# Altium schematic sheet MB-02-MainController.SchDoc
size 330 x 228 mm
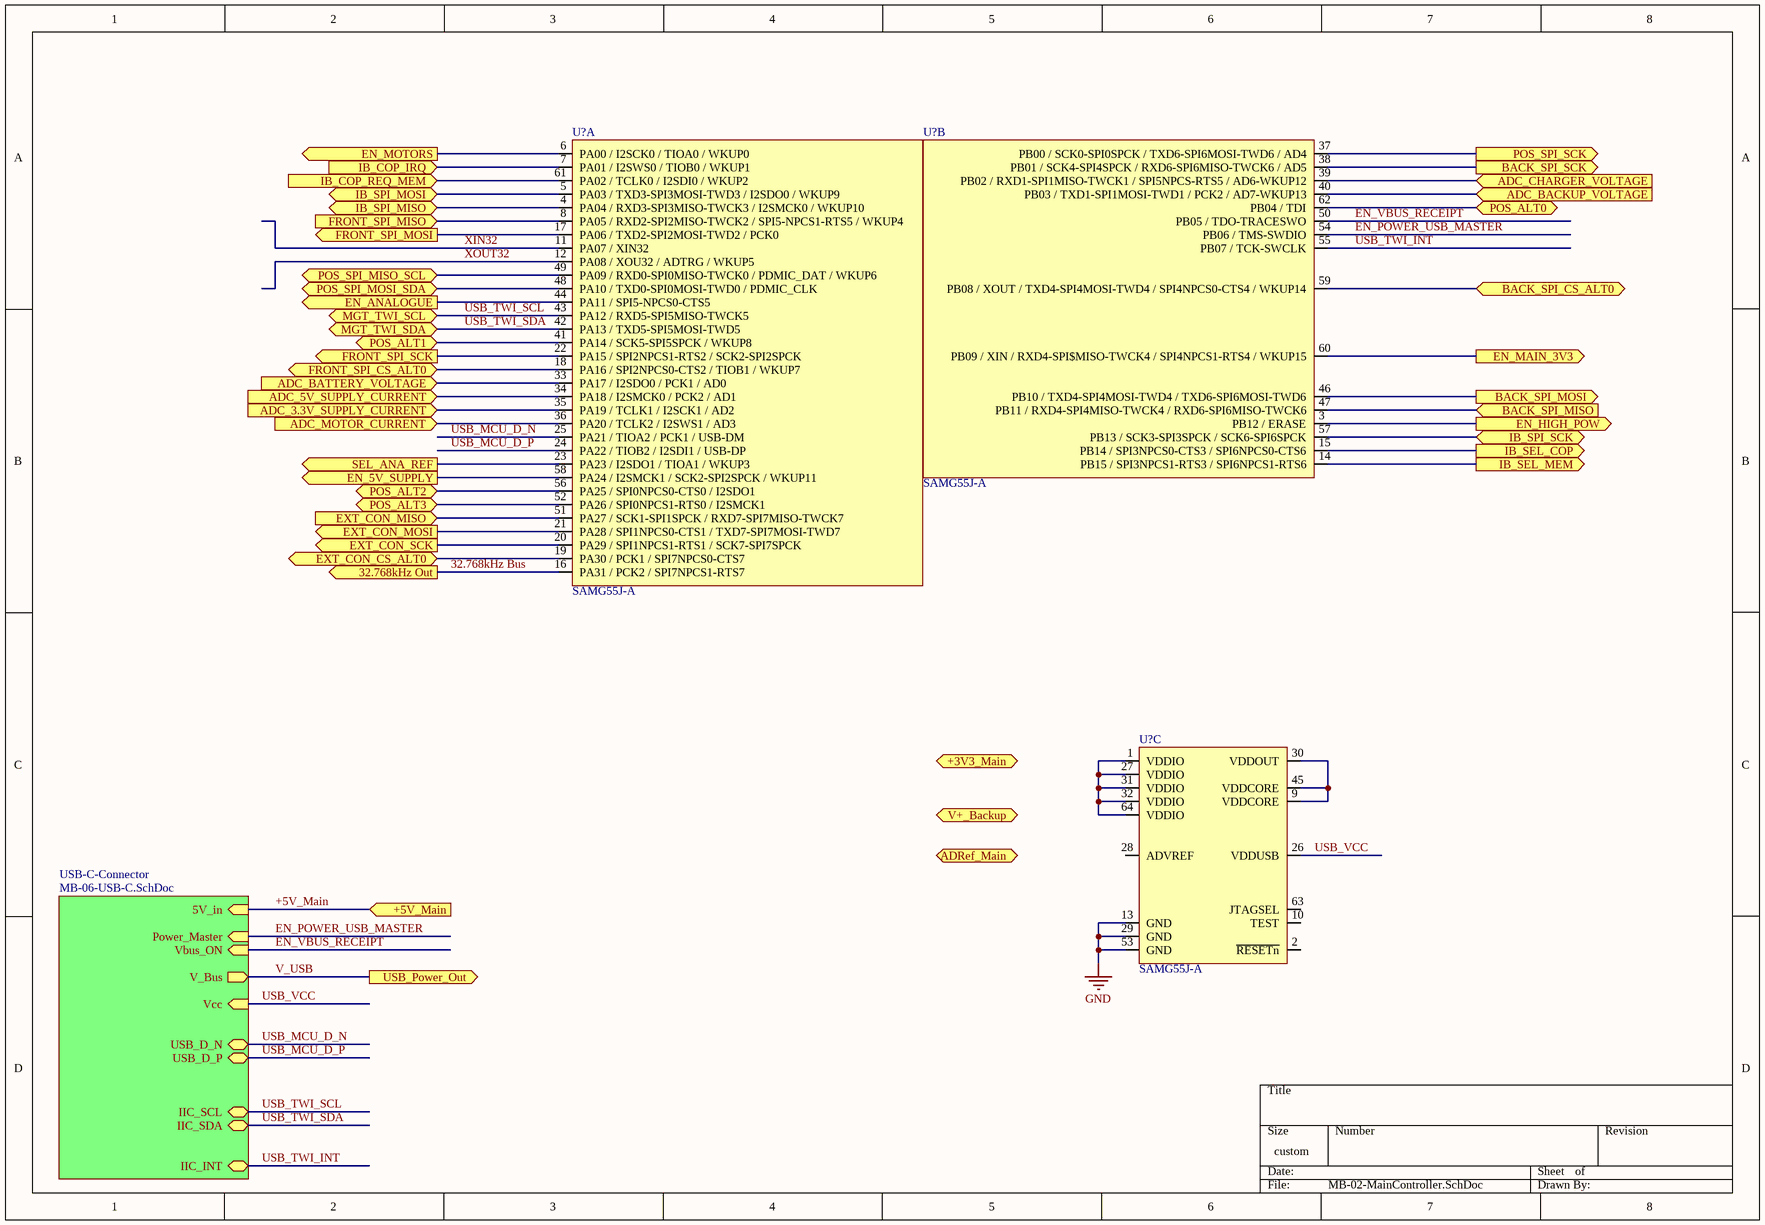
[diagram p0: MB-02-MainController.SchDoc]

## Parts
(Parts that share a designator on the sheet are numbered #1, #2 ... from top to bottom, then left to right.)
U?#1  SAMG55J-A  (part A of 3)
U?#2  SAMG55J-A  (part B of 3)
U?#3  SAMG55J-A  (part C of 3)

## Sub-sheets
USB-C-Connector = MB-06-USB-C.SchDoc: USB_D_P (bidir), USB_D_N (bidir), IIC_SCL (bidir), IIC_SDA (bidir), IIC_INT (bidir), V_Bus (out), Vcc (in), 5V_in (in), Power_Master (in), Vbus_ON (in)

## Ports
32.768kHz Out (out), +3V3_Main (in), +5V_Main (in), ADC_3.3V_SUPPLY_CURRENT (in), ADC_5V_SUPPLY_CURRENT (in), ADC_BACKUP_VOLTAGE (in), ADC_BATTERY_VOLTAGE (in), ADC_CHARGER_VOLTAGE (in), ADC_MOTOR_CURRENT (in), ADRef_Main (in), BACK_SPI_CS_ALT0 (bidir), BACK_SPI_MISO (in), BACK_SPI_MOSI (out), BACK_SPI_SCK (out), EN_5V_SUPPLY (out), EN_ANALOGUE (out), EN_HIGH_POW (out), EN_MAIN_3V3 (out), EN_MOTORS (out), EXT_CON_CS_ALT0 (bidir), EXT_CON_MISO (in), EXT_CON_MOSI (out), EXT_CON_SCK (out), FRONT_SPI_CS_ALT0 (bidir), FRONT_SPI_MISO (in), FRONT_SPI_MOSI (out), FRONT_SPI_SCK (out), IB_COP_IRQ (in), IB_COP_REQ_MEM (in), IB_SEL_COP (out), IB_SEL_MEM (out), IB_SPI_MISO (bidir), IB_SPI_MOSI (bidir), IB_SPI_SCK (bidir), MGT_TWI_SCL (bidir), MGT_TWI_SDA (bidir), POS_ALT0 (bidir), POS_ALT1 (bidir), POS_ALT2 (bidir), POS_ALT3 (bidir), POS_SPI_MISO_SCL (bidir), POS_SPI_MOSI_SDA (bidir), POS_SPI_SCK (out), SEL_ANA_REF (out), USB_Power_Out (out), V+_Backup (in)

## Nets
GND: U?#3.13(GND) U?#3.29(GND) U?#3.53(GND)
32.768kHz Bus: U?#1.16(PA31_/_PCK2_/_SPI7NPCS1-RTS7) ; port 32.768kHz Out
+5V_Main: port +5V_Main, sheet USB-C-Connector/5V_in
ADC_3.3V_SUPPLY_CURRENT: U?#1.35(PA19_/_TCLK1_/_I2SCK1_/_AD2) ; port ADC_3.3V_SUPPLY_CURRENT
ADC_5V_SUPPLY_CURRENT: U?#1.34(PA18_/_I2SMCK0_/_PCK2_/_AD1) ; port ADC_5V_SUPPLY_CURRENT
ADC_BACKUP_VOLTAGE: U?#2.40(PB03_/_TXD1-SPI1MOSI-TWD1_/_PCK2_/_AD7-WKUP13) ; port ADC_BACKUP_VOLTAGE
ADC_BATTERY_VOLTAGE: U?#1.33(PA17_/_I2SDO0_/_PCK1_/_AD0) ; port ADC_BATTERY_VOLTAGE
ADC_CHARGER_VOLTAGE: U?#2.39(PB02_/_RXD1-SPI1MISO-TWCK1_/_SPI5NPCS-RTS5_/_AD6-WKUP12) ; port ADC_CHARGER_VOLTAGE
ADC_MOTOR_CURRENT: U?#1.36(PA20_/_TCLK2_/_I2SWS1_/_AD3) ; port ADC_MOTOR_CURRENT
BACK_SPI_CS_ALT0: U?#2.59(PB08_/_XOUT_/_TXD4-SPI4MOSI-TWD4_/_SPI4NPCS0-CTS4_/_WKUP14) ; port BACK_SPI_CS_ALT0
BACK_SPI_MISO: U?#2.47(PB11_/_RXD4-SPI4MISO-TWCK4_/_RXD6-SPI6MISO-TWCK6) ; port BACK_SPI_MISO
BACK_SPI_MOSI: U?#2.46(PB10_/_TXD4-SPI4MOSI-TWD4_/_TXD6-SPI6MOSI-TWD6) ; port BACK_SPI_MOSI
BACK_SPI_SCK: U?#2.38(PB01_/_SCK4-SPI4SPCK_/_RXD6-SPI6MISO-TWCK6_/_AD5) ; port BACK_SPI_SCK
EN_5V_SUPPLY: U?#1.58(PA24_/_I2SMCK1_/_SCK2-SPI2SPCK_/_WKUP11) ; port EN_5V_SUPPLY
EN_ANALOGUE: U?#1.44(PA11_/_SPI5-NPCS0-CTS5) ; port EN_ANALOGUE
EN_HIGH_POW: U?#2.3(PB12_/_ERASE) ; port EN_HIGH_POW
EN_MAIN_3V3: U?#2.60(PB09_/_XIN_/_RXD4-SPI$MISO-TWCK4_/_SPI4NPCS1-RTS4_/_WKUP15) ; port EN_MAIN_3V3
EN_MOTORS: U?#1.6(PA00_/_I2SCK0_/_TIOA0_/_WKUP0) ; port EN_MOTORS
EN_POWER_USB_MASTER: U?#2.54(PB06_/_TMS-SWDIO) ; sheet USB-C-Connector/Power_Master
EN_VBUS_RECEIPT: U?#2.50(PB05_/_TDO-TRACESWO) ; sheet USB-C-Connector/Vbus_ON
EXT_CON_CS_ALT0: U?#1.19(PA30_/_PCK1_/_SPI7NPCS0-CTS7) ; port EXT_CON_CS_ALT0
EXT_CON_MISO: U?#1.51(PA27_/_SCK1-SPI1SPCK_/_RXD7-SPI7MISO-TWCK7) ; port EXT_CON_MISO
EXT_CON_MOSI: U?#1.21(PA28_/_SPI1NPCS0-CTS1_/_TXD7-SPI7MOSI-TWD7) ; port EXT_CON_MOSI
EXT_CON_SCK: U?#1.20(PA29_/_SPI1NPCS1-RTS1_/_SCK7-SPI7SPCK) ; port EXT_CON_SCK
FRONT_SPI_CS_ALT0: U?#1.18(PA16_/_SPI2NPCS0-CTS2_/_TIOB1_/_WKUP7) ; port FRONT_SPI_CS_ALT0
FRONT_SPI_MISO: U?#1.8(PA05_/_RXD2-SPI2MISO-TWCK2_/_SPI5-NPCS1-RTS5_/_WKUP4) ; port FRONT_SPI_MISO
FRONT_SPI_MOSI: U?#1.17(PA06_/_TXD2-SPI2MOSI-TWD2_/_PCK0) ; port FRONT_SPI_MOSI
FRONT_SPI_SCK: U?#1.22(PA15_/_SPI2NPCS1-RTS2_/_SCK2-SPI2SPCK) ; port FRONT_SPI_SCK
IB_COP_IRQ: U?#1.7(PA01_/_I2SWS0_/_TIOB0_/_WKUP1) ; port IB_COP_IRQ
IB_COP_REQ_MEM: U?#1.61(PA02_/_TCLK0_/_I2SDI0_/_WKUP2) ; port IB_COP_REQ_MEM
IB_SEL_COP: U?#2.15(PB14_/_SPI3NPCS0-CTS3_/_SPI6NPCS0-CTS6) ; port IB_SEL_COP
IB_SEL_MEM: U?#2.14(PB15_/_SPI3NPCS1-RTS3_/_SPI6NPCS1-RTS6) ; port IB_SEL_MEM
IB_SPI_MISO: U?#1.4(PA04_/_RXD3-SPI3MISO-TWCK3_/_I2SMCK0_/_WKUP10) ; port IB_SPI_MISO
IB_SPI_MOSI: U?#1.5(PA03_/_TXD3-SPI3MOSI-TWD3_/_I2SDO0_/_WKUP9) ; port IB_SPI_MOSI
IB_SPI_SCK: U?#2.57(PB13_/_SCK3-SPI3SPCK_/_SCK6-SPI6SPCK) ; port IB_SPI_SCK
POS_ALT0: U?#2.62(PB04_/_TDI) ; port POS_ALT0
POS_ALT1: U?#1.41(PA14_/_SCK5-SPI5SPCK_/_WKUP8) ; port POS_ALT1
POS_ALT2: U?#1.56(PA25_/_SPI0NPCS0-CTS0_/_I2SDO1) ; port POS_ALT2
POS_ALT3: U?#1.52(PA26_/_SPI0NPCS1-RTS0_/_I2SMCK1) ; port POS_ALT3
POS_SPI_MISO_SCL: U?#1.49(PA09_/_RXD0-SPI0MISO-TWCK0_/_PDMIC_DAT_/_WKUP6) ; port POS_SPI_MISO_SCL
POS_SPI_MOSI_SDA: U?#1.48(PA10_/_TXD0-SPI0MOSI-TWD0_/_PDMIC_CLK) ; port POS_SPI_MOSI_SDA
POS_SPI_SCK: U?#2.37(PB00_/_SCK0-SPI0SPCK_/_TXD6-SPI6MOSI-TWD6_/_AD4) ; port POS_SPI_SCK
SEL_ANA_REF: U?#1.23(PA23_/_I2SDO1_/_TIOA1_/_WKUP3) ; port SEL_ANA_REF
USB_MCU_D_N: U?#1.25(PA21_/_TIOA2_/_PCK1_/_USB-DM) ; sheet USB-C-Connector/USB_D_N
USB_MCU_D_P: U?#1.24(PA22_/_TIOB2_/_I2SDI1_/_USB-DP) ; sheet USB-C-Connector/USB_D_P
USB_TWI_INT: U?#2.55(PB07_/_TCK-SWCLK) ; sheet USB-C-Connector/IIC_INT
USB_TWI_SCL: U?#1.43(PA12_/_RXD5-SPI5MISO-TWCK5) ; port MGT_TWI_SCL, sheet USB-C-Connector/IIC_SCL
USB_TWI_SDA: U?#1.42(PA13_/_TXD5-SPI5MOSI-TWD5) ; port MGT_TWI_SDA, sheet USB-C-Connector/IIC_SDA
USB_VCC: U?#3.26(VDDUSB) ; sheet USB-C-Connector/Vcc
V_USB: port USB_Power_Out, sheet USB-C-Connector/V_Bus
XIN32: U?#1.11(PA07_/_XIN32)
XOUT32: U?#1.12(PA08_/_XOU32_/_ADTRG_/_WKUP5)
NetU?#3_1: U?#3.1(VDDIO) U?#3.27(VDDIO) U?#3.31(VDDIO) U?#3.32(VDDIO) U?#3.64(VDDIO)
NetU?#3_9: U?#3.9(VDDCORE) U?#3.30(VDDOUT) U?#3.45(VDDCORE)

Not connected (* = marked no-connect by the designer): U?#3 2(~{RESETn}) 10(TEST) 28(ADVREF) 63(JTAGSEL)

## Library data of the parts
U?#1-U?#3 = CHIP_ATM_SAMG55J-A: Atmel ARM Cortex M4, 64pin QFP